# Altium schematic sheet BNO055 Host.SchDoc
size A
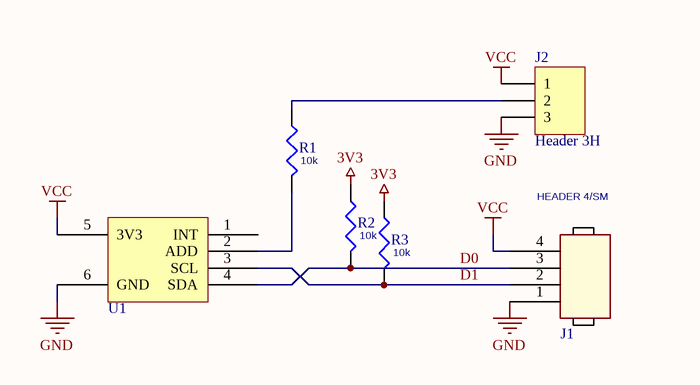
[diagram p0: BNO055 Host.SchDoc]

## Parts
J1  HEADER 4/SM  [61900411021 - flip]
J2  Header 3H  [SolderJumper]
R1  10k  [RESC402N]
R2  10k  [RESC402N]
R3  10k  [RESC402N]
U1  BNO055  [BNO055]  (value not drawn)

## Nets
3V3: R2.1 R3.1
GND: J1.1 J2.3 U1.6(GND)
VCC: J1.4 J2.1 U1.5(3V3)
D0: J1.3 R2.2 U1.4(SDA)
D1: J1.2 R3.2 U1.3(SCL)
NetJ2_2: J2.2 R1.1
NetR1_2: R1.2 U1.2(ADD)

Not connected (* = marked no-connect by the designer): U1 1(INT)

## Library data of the parts
J2 = Header 3H: Header, 3-Pin, Right Angle; LatestRevisionDate: 17-Jul-2002; LatestRevisionNote: Re-released for DXP Platform.; Publisher: Altium Limited
R1-R3 = RC0402FR-0710KL: RES SMD 10K OHM 1% 1/16W 0402
U1 = BNO055 Nano: PESKY PRODUCTS BNO-055 NANO BREAKOUT BOARD